# EAGLE design slave-16-mosfet (EAGLE 9.6.2)
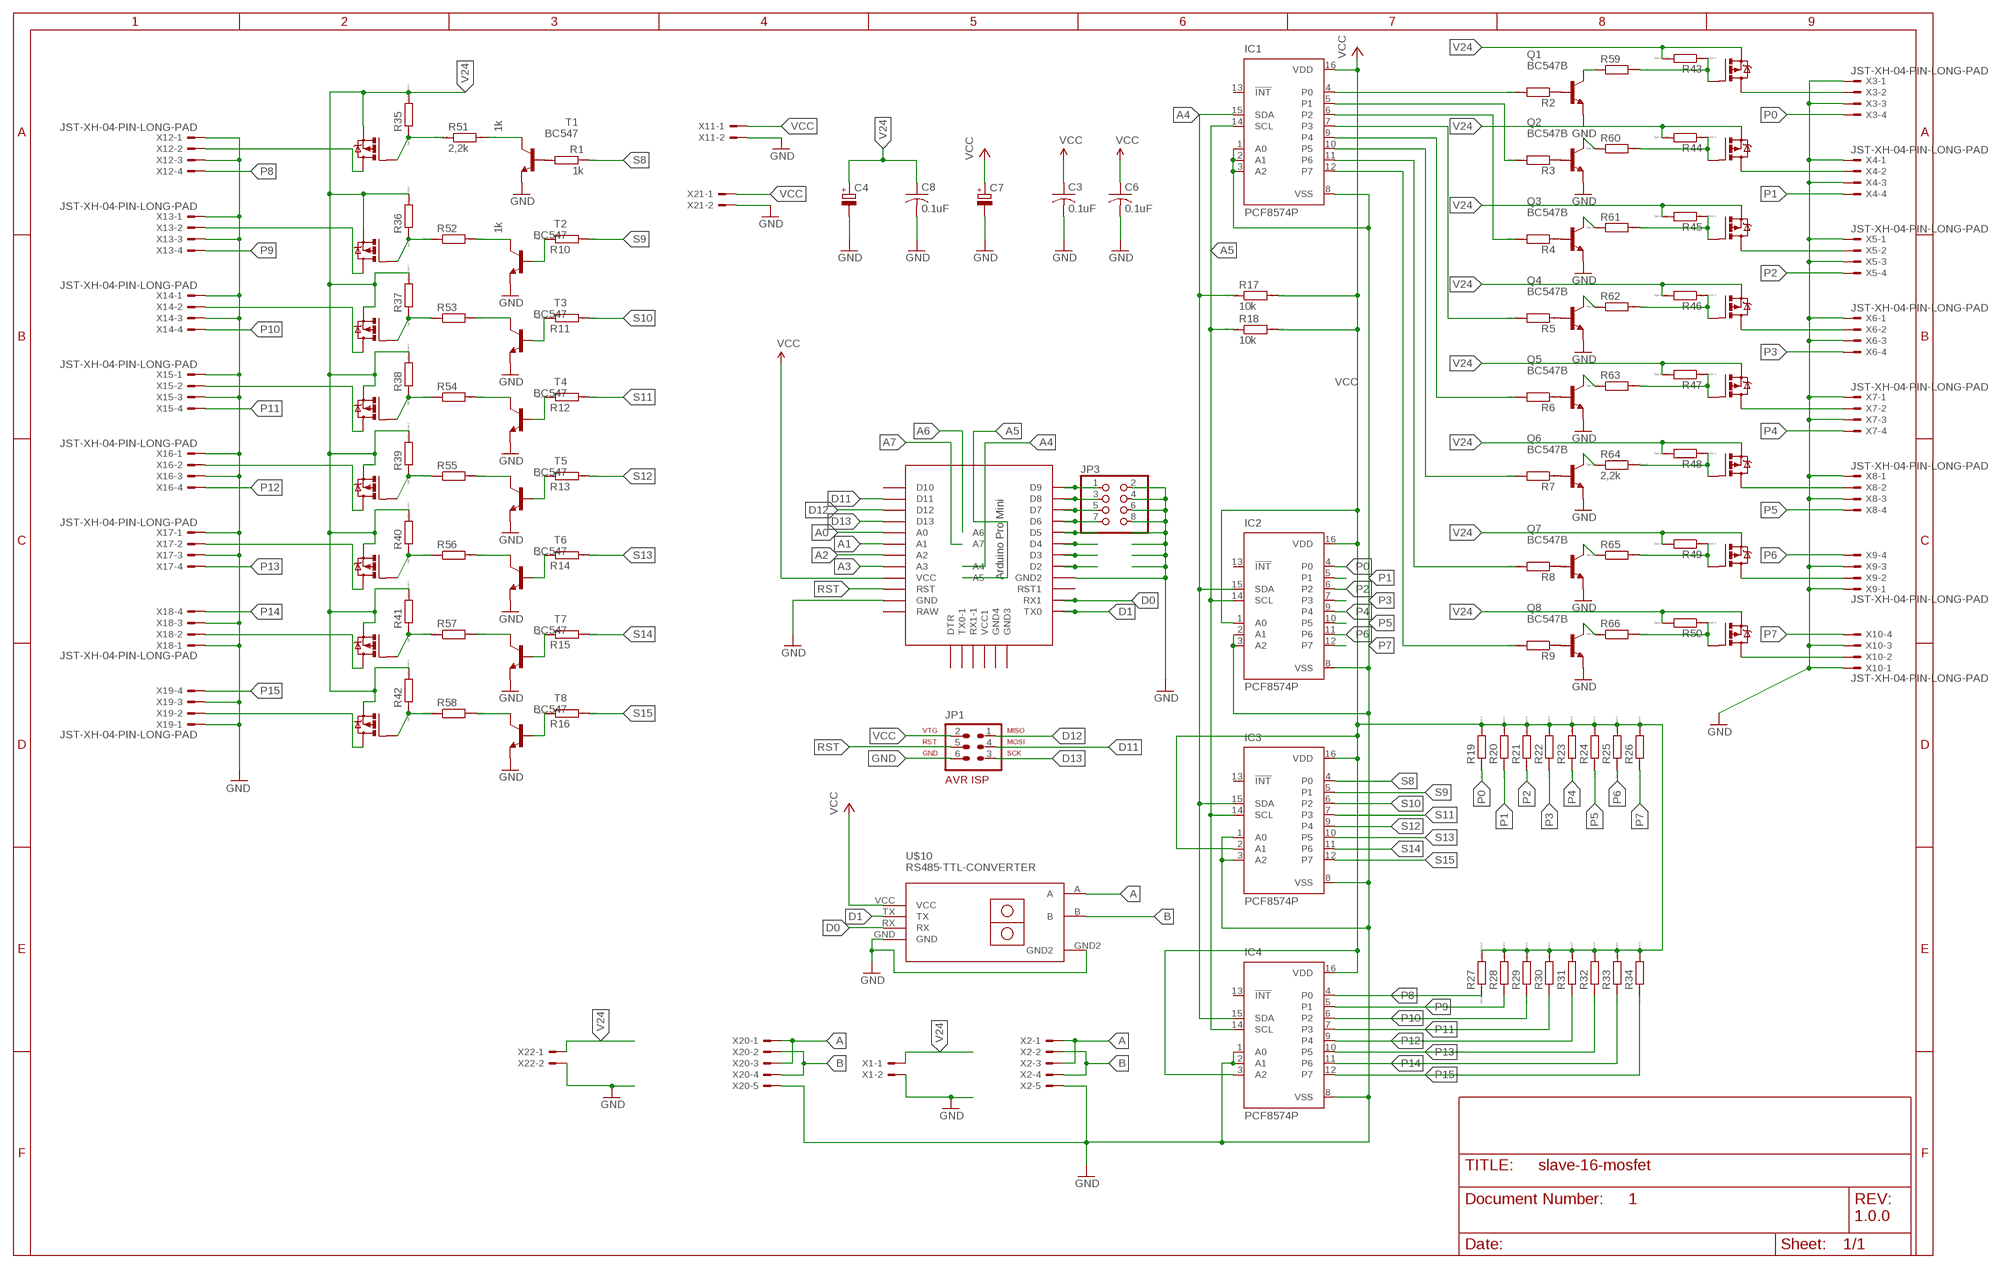
[diagram p0: schematic, sheet 1]
FRAME1 (FRAME_B_L): DESIGNER: PRATIK MAKWANA; DOC: 1; REV: 1.0.0

## Parts
C3  0.1uF  C-USC0805  [C0805]
C4  CPOL-EUSANYO_SMD_C6  [SANYO-OSCON_SMD_C6]
C6  0.1uF  C-USC0805  [C0805]
C7  CPOL-EUSANYO_SMD_C6  [SANYO-OSCON_SMD_C6]
C8  0.1uF  C-USC0805  [C0805]
IC1  PCF8574P  [DIL16]
IC2  PCF8574P  [DIL16]
IC3  PCF8574P  [DIL16]
IC4  PCF8574P  [DIL16]
JP1  AVR-ISP-6  [AVR-ISP-6]
JP3  PINHD-2X4  [2X04]
Q1  BC547B  [TO92]
Q2  BC547B  [TO92]
Q3  BC547B  [TO92]
Q4  BC547B  [TO92]
Q5  BC547B  [TO92]
Q6  BC547B  [TO92]
Q7  BC547B  [TO92]
Q8  BC547B  [TO92]
R1  1k  RR1206  [R1206]
R2  RR1206  [R1206]
R3  RR1206  [R1206]
R4  RR1206  [R1206]
R5  RR1206  [R1206]
R6  RR1206  [R1206]
R7  RR1206  [R1206]
R8  RR1206  [R1206]
R9  RR1206  [R1206]
R10  RR1206  [R1206]
R11  RR1206  [R1206]
R12  RR1206  [R1206]
R13  RR1206  [R1206]
R14  RR1206  [R1206]
R15  RR1206  [R1206]
R16  RR1206  [R1206]
R17  10k  RR1206  [R1206]
R18  10k  RR1206  [R1206]
R19  RR1206  [R1206]
R20  RR1206  [R1206]
R21  RR1206  [R1206]
R22  RR1206  [R1206]
R23  RR1206  [R1206]
R24  RR1206  [R1206]
R25  RR1206  [R1206]
R26  RR1206  [R1206]
R27  RR1206  [R1206]
R28  RR1206  [R1206]
R29  RR1206  [R1206]
R30  RR1206  [R1206]
R31  RR1206  [R1206]
R32  RR1206  [R1206]
R33  RR1206  [R1206]
R34  RR1206  [R1206]
R35  1k  RR1206  [R1206]
R36  1k  RR1206  [R1206]
R37  RR1206  [R1206]
R38  RR1206  [R1206]
R39  RR1206  [R1206]
R40  RR1206  [R1206]
R41  RR1206  [R1206]
R42  RR1206  [R1206]
R43  RR1206  [R1206]
R44  RR1206  [R1206]
R45  RR1206  [R1206]
R46  RR1206  [R1206]
R47  RR1206  [R1206]
R48  RR1206  [R1206]
R49  RR1206  [R1206]
R50  RR1206  [R1206]
R51  2,2k  RR1206  [R1206]
R52  RR1206  [R1206]
R53  RR1206  [R1206]
R54  RR1206  [R1206]
R55  RR1206  [R1206]
R56  RR1206  [R1206]
R57  RR1206  [R1206]
R58  RR1206  [R1206]
R59  RR1206  [R1206]
R60  RR1206  [R1206]
R61  RR1206  [R1206]
R62  RR1206  [R1206]
R63  RR1206  [R1206]
R64  2,2k  RR1206  [R1206]
R65  RR1206  [R1206]
R66  RR1206  [R1206]
T1  BC547  [TO92]
T2  BC547  [TO92]
T3  BC547  [TO92]
T4  BC547  [TO92]
T5  BC547  [TO92]
T6  BC547  [TO92]
T7  BC547  [TO92]
T8  BC547  [TO92]
U$1  IRF9530  [TO220BV]
U$2  IRF9530  [TO220BV]
U$3  IRF9530  [TO220BV]
U$4  IRF9530  [TO220BV]
U$5  IRF9530  [TO220BV]
U$6  IRF9530  [TO220BV]
U$7  IRF9530  [TO220BV]
U$8  IRF9530  [TO220BV]
U$10  RS485-TTL-CONVERTER  [RS485-TTL-CONVERTER]
U$12  IRF9530  [TO220BV]
U$13  IRF9530  [TO220BV]
U$14  IRF9530  [TO220BV]
U$15  IRF9530  [TO220BV]
U$16  IRF9530  [TO220BV]
U$17  IRF9530  [TO220BV]
U$18  IRF9530  [TO220BV]
U$19  IRF9530  [TO220BV]
U$20  PRO-MINI-2  [PRO-MINI-2]
X1  JST-XH-02-PIN-LONG-PAD  [JST-XH-02-PACKAGE-LONG-PAD]
X2  JST-XH-05-PIN-LONG-PAD  [JST-XH-05-PACKAGE-LONG-PAD]
X3  JST-XH-04-PIN-LONG-PAD  [JST-XH-04-PACKAGE-LONG-PAD]
X4  JST-XH-04-PIN-LONG-PAD  [JST-XH-04-PACKAGE-LONG-PAD]
X5  JST-XH-04-PIN-LONG-PAD  [JST-XH-04-PACKAGE-LONG-PAD]
X6  JST-XH-04-PIN-LONG-PAD  [JST-XH-04-PACKAGE-LONG-PAD]
X7  JST-XH-04-PIN-LONG-PAD  [JST-XH-04-PACKAGE-LONG-PAD]
X8  JST-XH-04-PIN-LONG-PAD  [JST-XH-04-PACKAGE-LONG-PAD]
X9  JST-XH-04-PIN-LONG-PAD  [JST-XH-04-PACKAGE-LONG-PAD]
X10  JST-XH-04-PIN-LONG-PAD  [JST-XH-04-PACKAGE-LONG-PAD]
X11  JST-XH-02-PIN-LONG-PAD  [JST-XH-02-PACKAGE-LONG-PAD]
X12  JST-XH-04-PIN-LONG-PAD  [JST-XH-04-PACKAGE-LONG-PAD]
X13  JST-XH-04-PIN-LONG-PAD  [JST-XH-04-PACKAGE-LONG-PAD]
X14  JST-XH-04-PIN-LONG-PAD  [JST-XH-04-PACKAGE-LONG-PAD]
X15  JST-XH-04-PIN-LONG-PAD  [JST-XH-04-PACKAGE-LONG-PAD]
X16  JST-XH-04-PIN-LONG-PAD  [JST-XH-04-PACKAGE-LONG-PAD]
X17  JST-XH-04-PIN-LONG-PAD  [JST-XH-04-PACKAGE-LONG-PAD]
X18  JST-XH-04-PIN-LONG-PAD  [JST-XH-04-PACKAGE-LONG-PAD]
X19  JST-XH-04-PIN-LONG-PAD  [JST-XH-04-PACKAGE-LONG-PAD]
X20  JST-XH-05-PIN-LONG-PAD  [JST-XH-05-PACKAGE-LONG-PAD]
X21  JST-XH-02-PIN-LONG-PAD  [JST-XH-02-PACKAGE-LONG-PAD]
X22  JST-XH-02-PIN-LONG-PAD  [JST-XH-02-PACKAGE-LONG-PAD]

## Nets
A: U$10.A X2.1 X2.3 X20.1 X20.3
A0: U$20.A0
A1: U$20.A1
A2: U$20.A2
A3: U$20.A3
A4: IC1.15(SDA) IC2.15(SDA) IC3.15(SDA) IC4.15(SDA) R17.1 U$20.A4
A5: IC1.14(SCL) IC2.14(SCL) IC3.14(SCL) IC4.14(SCL) R18.1 U$20.A5
A6: U$20.A6
A7: U$20.A7
B: U$10.B X2.2 X2.4 X20.2 X20.4
D0: U$10.RX U$20.RX1
D1: U$10.TX U$20.TX0
D11: JP1.4 U$20.D11
D12: JP1.1 U$20.D12
D13: JP1.3 U$20.D13
GND: C3.2 C4.- C6.2 C7.- C8.2 IC1.1(A0) IC1.2(A1) IC1.3(A2) IC1.8(VSS) IC2.2(A1) IC2.3(A2) IC2.8(VSS) IC3.1(A0) IC3.3(A2) IC3.8(VSS) IC4.1(A0) IC4.2(A1) IC4.8(VSS) JP1.6 JP3.2 JP3.4 JP3.6 JP3.8 Q1.1(E) Q2.1(E) Q3.1(E) Q4.1(E) Q5.1(E) Q6.1(E) Q7.1(E) Q8.1(E) T1.1(E) T2.1(E) T3.1(E) T4.1(E) T5.1(E) T6.1(E) T7.1(E) T8.1(E) U$10.GND U$10.GND2 U$20.GND U$20.GND1(GND2) X1.2 X2.5 X3.1 X3.3 X4.1 X4.3 X5.1 X5.3 X6.1 X6.3 X7.1 X7.3 X8.1 X8.3 X9.1 X9.3 X10.1 X10.3 X11.2 X12.1 X12.3 X13.1 X13.3 X14.1 X14.3 X15.1 X15.3 X16.1 X16.3 X17.1 X17.3 X18.1 X18.3 X19.1 X19.3 X20.5 X21.2 X22.2
N$1: Q8.2(B) R9.1
N$2: Q7.2(B) R8.1
N$3: R15.1 T7.2(B)
N$4: Q6.2(B) R7.1
N$5: Q5.2(B) R6.1
N$6: Q4.2(B) R5.1
N$7: Q3.2(B) R4.1
N$8: Q2.2(B) R3.1
N$9: Q1.2(B) R2.1
N$10: U$20.D2
N$12: R44.1 R60.2 U$2.G
N$13: R45.1 R61.2 U$3.G
N$14: R46.1 R62.2 U$4.G
N$15: U$1.D X3.2
N$16: U$2.D X4.2
N$17: U$20.D3
N$18: U$3.D X5.2
N$19: U$4.D X6.2
N$20: U$20.D4
N$21: U$20.D5
N$22: JP3.7 U$20.D6
N$23: JP3.5 U$20.D7
N$24: JP3.3 U$20.D8
N$25: JP3.1 U$20.D9
N$26: R1.2 T1.2(B)
N$27: R35.1 R51.1 U$12.G
N$28: R42.1 R58.1 U$19.G
N$29: R40.1 R56.1 U$17.G
N$30: IC1.4(P0) R2.2
N$31: IC1.5(P1) R3.2
N$32: IC1.6(P2) R4.2
N$33: IC1.7(P3) R5.2
N$34: IC1.9(P4) R6.2
N$35: IC1.10(P5) R7.2
N$36: IC1.11(P6) R8.2
N$37: IC1.12(P7) R9.2
N$38: R16.1 T8.2(B)
N$39: R14.1 T6.2(B)
N$40: U$5.D X7.2
N$41: U$6.D X8.2
N$42: U$7.D X9.2
N$43: R39.1 R55.1 U$16.G
N$44: R41.1 R57.1 U$18.G
N$45: R13.1 T5.2(B)
N$46: U$12.D X12.2
N$47: U$13.D X13.2
N$48: U$14.D X14.2
N$49: U$15.D X15.2
N$50: U$16.D X16.2
N$51: U$17.D X17.2
N$52: U$18.D X18.2
N$53: U$19.D X19.2
N$54: U$8.D X10.2
N$55: R38.1 R54.1 U$15.G
N$56: R50.1 R66.2 U$8.G
N$57: R12.1 T4.2(B)
N$58: R37.1 R53.1 U$14.G
N$59: R49.1 R65.2 U$7.G
N$60: R11.1 T3.2(B)
N$61: R10.1 T2.2(B)
N$62: R36.1 R52.1 U$13.G
N$63: R48.1 R64.2 U$6.G
N$64: R47.1 R63.2 U$5.G
N$65: R58.2 T8.3(C)
N$66: R57.2 T7.3(C)
N$67: R56.2 T6.3(C)
N$68: R55.2 T5.3(C)
N$69: R54.2 T4.3(C)
N$70: R53.2 T3.3(C)
N$71: R52.2 T2.3(C)
N$72: R51.2 T1.3(C)
N$73: Q8.3(C) R66.1
N$74: Q7.3(C) R65.1
N$75: Q6.3(C) R64.1
N$76: Q5.3(C) R63.1
N$77: Q4.3(C) R62.1
N$78: Q3.3(C) R61.1
N$79: Q2.3(C) R60.1
N$80: Q1.3(C) R59.1
N$81: R43.1 R59.2 U$1.G
P0: IC2.4(P0) R19.1 X3.4
P1: IC2.5(P1) R20.1 X4.4
P2: IC2.6(P2) R21.1 X5.4
P3: IC2.7(P3) R22.1 X6.4
P4: IC2.9(P4) R23.1 X7.4
P5: IC2.10(P5) R24.1 X8.4
P6: IC2.11(P6) R25.1 X9.4
P7: IC2.12(P7) R26.1 X10.4
P8: IC4.4(P0) R27.1 X12.4
P9: IC4.5(P1) R28.1 X13.4
P10: IC4.6(P2) R29.1 X14.4
P11: IC4.7(P3) R30.1 X15.4
P12: IC4.9(P4) R31.1 X16.4
P13: IC4.10(P5) R32.1 X17.4
P14: IC4.11(P6) R33.1 X18.4
P15: IC4.12(P7) R34.1 X19.4
RST: JP1.5 U$20.RST
S8: IC3.4(P0) R1.1
S9: IC3.5(P1) R10.2
S10: IC3.6(P2) R11.2
S11: IC3.7(P3) R12.2
S12: IC3.9(P4) R13.2
S13: IC3.10(P5) R14.2
S14: IC3.11(P6) R15.2
S15: IC3.12(P7) R16.2
V24: C4.+ C8.1 R35.2 R36.2 R37.2 R38.2 R39.2 R40.2 R41.2 R42.2 R43.2 R44.2 R45.2 R46.2 R47.2 R48.2 R49.2 R50.2 U$1.S U$2.S U$3.S U$4.S U$5.S U$6.S U$7.S U$8.S U$12.S U$13.S U$14.S U$15.S U$16.S U$17.S U$18.S U$19.S X1.1 X22.1
VCC: C3.1 C6.1 C7.+ IC1.16(VDD) IC2.1(A0) IC2.16(VDD) IC3.2(A1) IC3.16(VDD) IC4.3(A2) IC4.16(VDD) JP1.2 R17.2 R18.2 R19.2 R20.2 R21.2 R22.2 R23.2 R24.2 R25.2 R26.2 R27.2 R28.2 R29.2 R30.2 R31.2 R32.2 R33.2 R34.2 U$10.VCC U$20.VCC X11.1 X21.1
Unconnected: IC1.13(!INT) IC2.13(!INT) IC3.13(!INT) IC4.13(!INT) U$20.D10 U$20.DTR U$20.GND2(GND3) U$20.GND3(GND4) U$20.RAW U$20.RST1 U$20.RX1-1 U$20.TX0-1 U$20.VCC1

## Library data of the parts
C3 C6 C8 = adafruit:C-US: CAPACITOR, American symbol
C4 C7 = rcl:CPOL-EU: POLARIZED CAPACITOR, European symbol; SPICEPREFIX: C
IC1-IC4 = micro-philips:PCF8574: I2C-Bus Remote 8-bit I/O expander http://www.semiconductors.philips.com/acrobat_download/datasheets/PCF8574_4.pdf; MPN: PCF8574PN; OC_FARNELL: 204020; OC_NEWARK: 11N8515
JP1 = atmel-1:AVR-ISP-6: AVR ISP-6 Serial Programming Header
JP3 = adafruit:PINHD-2X4: PIN HEADER
Q1-Q8 = transistor-npn:BC547*: NPN Transistor
R1-R66 = eagle-ltspice:R: RESISTOR, European symbol; SPICEMODEL: NONE; SPICEPREFIX: R
T1-T8 = transistor:BC547: NPN TRANSISTOR
U$1-U$8 U$12-U$19 = transistor-power:IRF9530: P-CHANNEL HEXFET POWER-MOS-FET Source: http://www.irf.com/product-info/datasheets/data/irf9530.pdf
U$10 = zort-library:RS485-TTL-CONVERTER: RS485 to TTL converter based on MAX485 chip
U$20 = Arduino-clone:PRO-MINI-2: Arduino Pro Mini Layout 2 Sparkfun.com
X1 X11 X21 X22 = Rembrandt Electronics - JST XH Connectors v1-0:JST-XH-02-PIN: JST XH Connector 2 Pin Wire to board connector. Pitch: 2,54 mm, (0.100") Number of pins: 2 Created by Rembrandt Electronics www.rembrandtelectronics.com
X2 X20 = Rembrandt Electronics - JST XH Connectors v1-0:JST-XH-05-PIN: JST XH Connector 2 Pin Wire to board connector. Pitch: 2,54 mm, (0.100") Number of pins: 5 Created by Rembrandt Electronics www.rembrandtelectronics.com
X3-X10 X12-X19 = Rembrandt Electronics - JST XH Connectors v1-0:JST-XH-04-PIN: JST XH Connector 2 Pin Wire to board connector. Pitch: 2,54 mm, (0.100") Number of pins: 4 Created by Rembrandt Electronics www.rembrandtelectronics.com

## Board
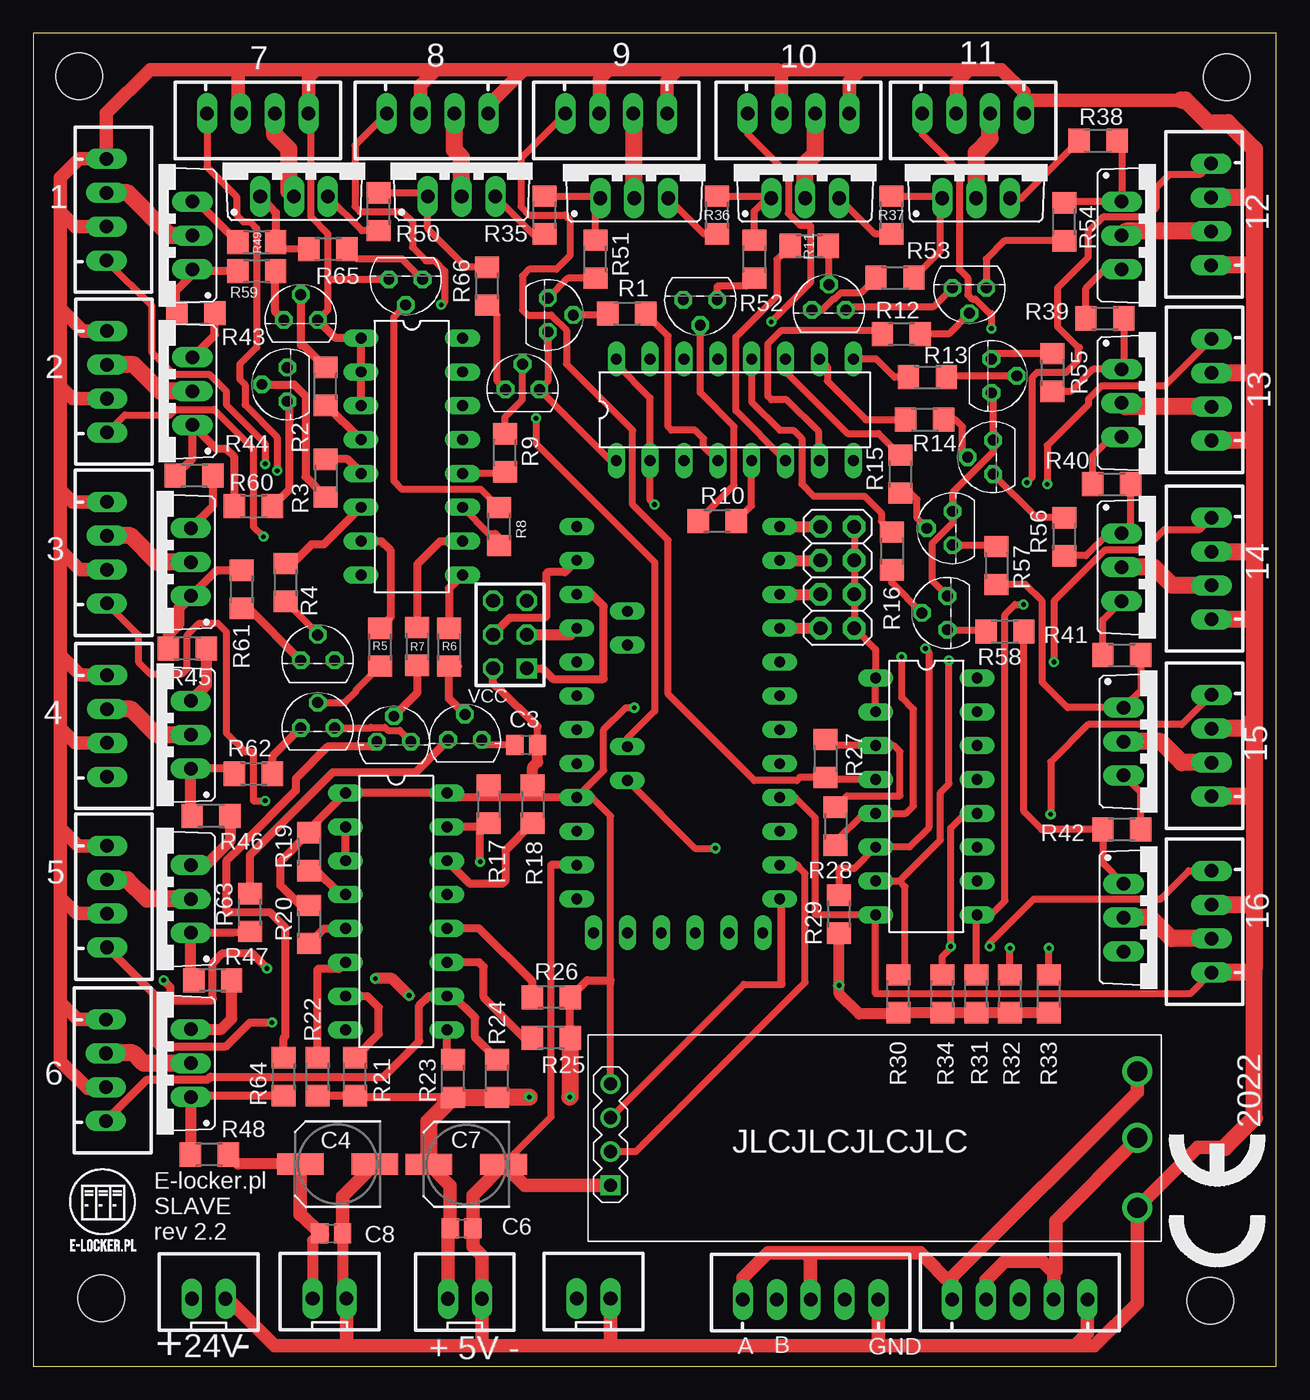
[diagram p1: board, top side]
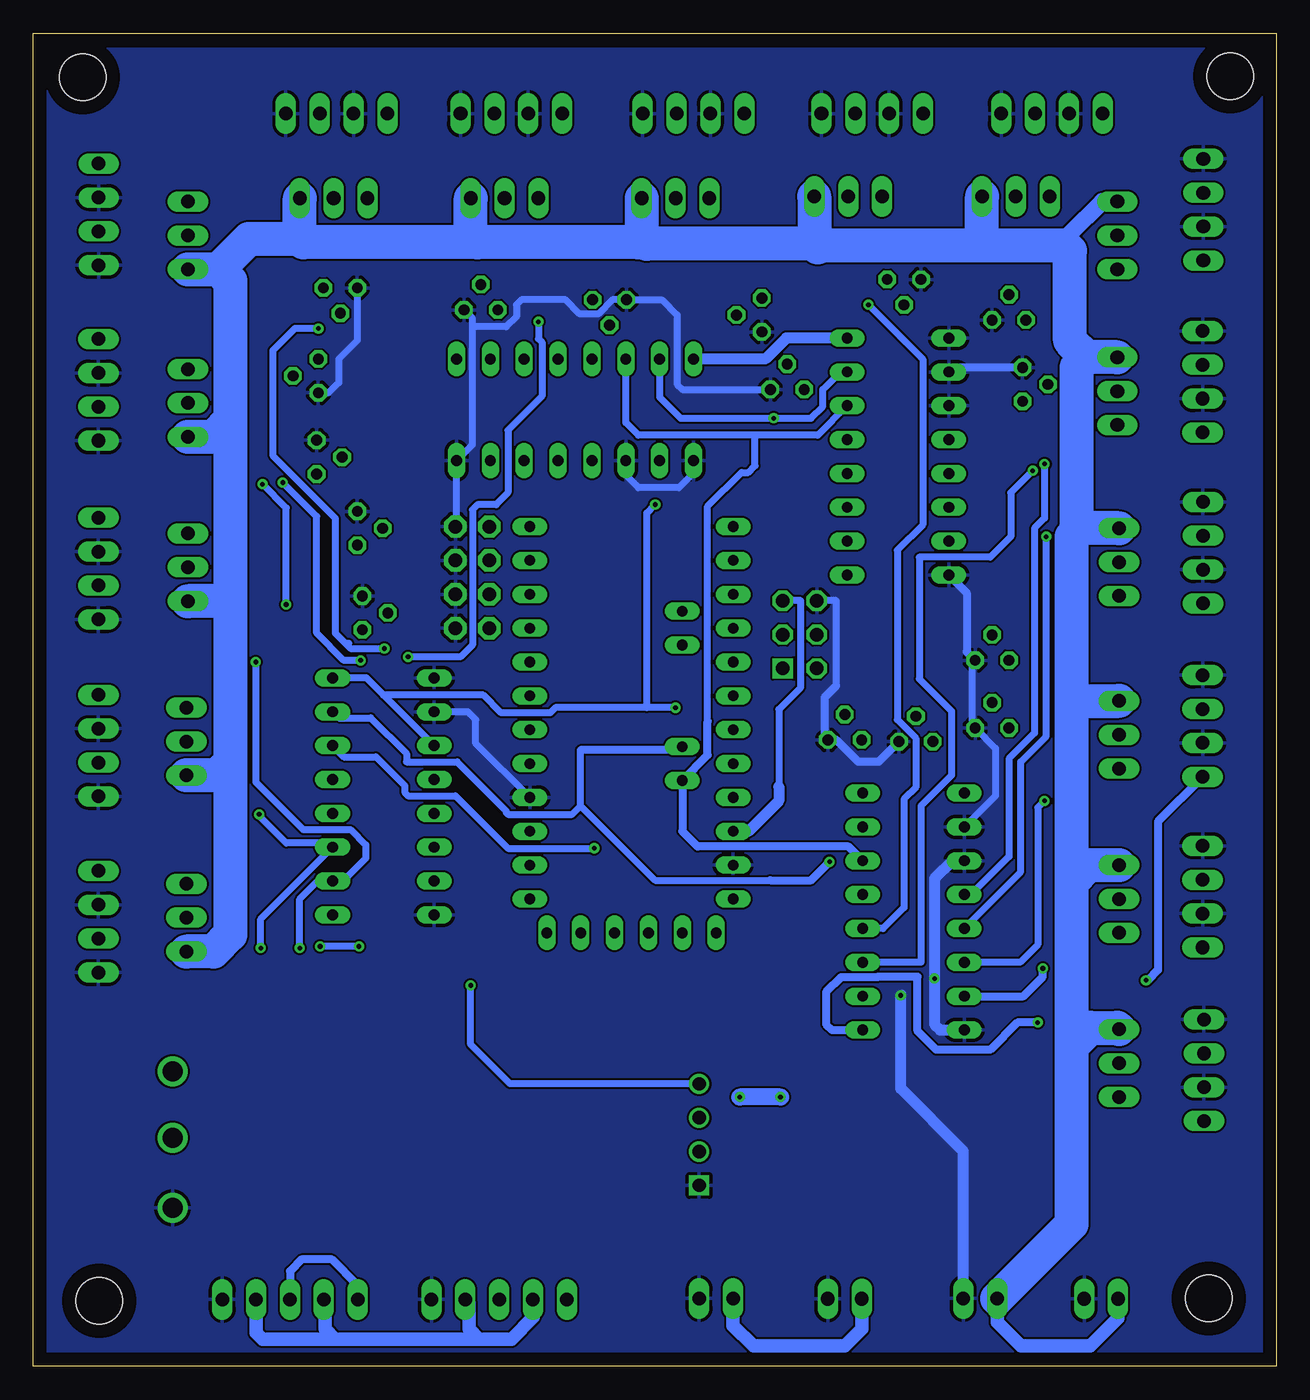
[diagram p2: board, bottom side, seen from below]

Size 93.27 x 100 mm. Coordinates in mm from the lower left corner, seen from the top.
Outline: 0,0 93.27,0 93.27,100 0,100 0,0
Copper layers (1*16): Top 0.035mm / dielectric 1.5mm / Bottom 0.035mm
Design rules "default": minimum track width 6mil, minimum drill 0.35mm, track to track 6mil, track to pad 6mil, pad to pad 6mil, via to via 6mil, smd to smd 6mil, copper to edge 40mil, drill to drill 6mil, minimum pad ring 10mil, minimum via ring 8mil, stop-mask expansion 4mil, vias tented up to drill 0mil, thermal gap 10mil
Holes 3.5 mm at 5.08,5.08 88.32,4.9 89.56,96.7 3.45,96.77

### Footprints (pad centres in the part's own frame; a part is rotated, then mirrored left to right if it is on the bottom)
C0805 = smd 1.3 x 1.5: 1 -0.85,0; 2 0.85,0
SANYO-OSCON_SMD_C6 = smd 3.5 x 1.6: + 2.8,0; - -2.8,0
DIL16 = drill 0.813 long: 1 -8.89,-3.81; 2 -6.35,-3.81; 3 -3.81,-3.81; 4 -1.27,-3.81; 5 1.27,-3.81; 6 3.81,-3.81; 7 6.35,-3.81; 8 8.89,-3.81; 9 8.89,3.81; 10 6.35,3.81; 11 3.81,3.81; 12 1.27,3.81; 13 -1.27,3.81; 14 -3.81,3.81; 15 -6.35,3.81; 16 -8.89,3.81
AVR-ISP-6 = drill 1.016 square: 1 -2.54,-1.27 | drill 1.016 octagon: 2 -2.54,1.27; 3 0,-1.27; 4 0,1.27; 5 2.54,-1.27; 6 2.54,1.27
2X04 = drill 1.016 pad 1.676 octagon: 1 -3.81,-1.27; 2 -3.81,1.27; 3 -1.27,-1.27; 4 -1.27,1.27; 5 1.27,-1.27; 6 1.27,1.27; 7 3.81,-1.27; 8 3.81,1.27
TO92 = drill 0.813 octagon: 1 1.27,0; 2 0,1.905; 3 -1.27,0
R1206 = smd 1.6 x 1.803: 1 -1.422,0; 2 1.422,0
TO220BV = drill 1.016 long: D 0,-2.54; G -2.54,-2.54; S 2.54,-2.54
RS485-TTL-CONVERTER = drill 1.5: A 41.2,12.75; B 41.2,7.75; GND2 41.2,2.5 | drill 1 square: GND 1.68,4.19 | drill 1: RX 1.68,6.73; TX 1.68,9.27; VCC 1.68,11.81
PRO-MINI-2 = drill 0.8 long: A0 6.35,2.54; A1 6.35,0; A2 6.35,-2.54; A3 6.35,-5.08; A4 2.54,1.27; A5 2.54,3.81; A6 2.54,-8.89; A7 2.54,-6.35; D2 -8.89,2.54; D3 -8.89,0; D4 -8.89,-2.54; D5 -8.89,-5.08; D6 -8.89,-7.62; D7 -8.89,-10.16; D8 -8.89,-12.7; D9 -8.89,-15.24; D10 6.35,-15.24; D11 6.35,-12.7; D12 6.35,-10.16; D13 6.35,-7.62; DTR 5.08,15.24; GND 6.35,10.16; GND1 -8.89,5.08; GND2 -7.62,15.24; GND3 -5.08,15.24; RAW 6.35,12.7; RST 6.35,7.62; RST1 -8.89,7.62; RX1 -8.89,10.16; RX1-1 0,15.24; TX0 -8.89,12.7; TX0-1 2.54,15.24; VCC 6.35,5.08; VCC1 -2.54,15.24
JST-XH-02-PACKAGE-LONG-PAD = drill 1.016 long: 1 -1.27,0; 2 1.27,0
JST-XH-05-PACKAGE-LONG-PAD = drill 1.016 long: 1 -5.08,0; 2 -2.54,0; 3 0,0; 4 2.54,0; 5 5.08,0
JST-XH-04-PACKAGE-LONG-PAD = drill 1.016 long: 1 -3.81,0; 2 -1.27,0; 3 1.27,0; 4 3.81,0

### Placement (x,y rotation side)
C3  36.98,46.61 180 top
C4  22.83,15.16 180 top
C6  32.13,10.34 0 top
C7  32.49,15.14 180 top
C8  22.35,9.96 0 top
IC1  28.4,68.25 270 top
IC2  27.23,34.11 270 top
IC3  52.63,71.75 0 top
IC4  67.01,42.75 270 top
JP1  35.76,54.89 90 top
JP3  60.33,59.18 270 top
Q1  20.07,78.49 0 top
Q2  19.05,73.66 90 top
Q3  21.34,52.96 0 top
Q4  21.34,47.88 0 top
Q5  32.38,46.99 0 top
Q6  27.05,46.86 0 top
Q7  27.94,81.53 180 top
Q8  36.7,73.28 0 top
R1  44.53,78.97 180 top
R2  21.92,73.51 270 top
R3  21.95,66.62 90 top
R4  18.92,58.8 90 top
R5  26.01,53.95 90 top
R6  31.19,53.95 90 top
R7  28.8,54 90 top
R8  34.95,62.99 270 top
R9  35.38,68.53 270 top
R10  51.31,63.4 0 top
R11  58.22,84.05 180 top
R12  65.13,77.44 180 top
R13  67.08,74.19 180 top
R14  66.88,71.02 180 top
R15  65.05,66.93 90 top
R16  64.41,61.16 90 top
R17  34.16,42.16 90 top
R18  37.47,42.16 90 top
R19  20.7,38.61 90 top
R20  20.7,33.15 90 top
R21  21.34,21.72 270 top
R22  24.13,21.72 270 top
R23  31.5,21.59 270 top
R24  34.8,21.59 270 top
R25  38.86,24.64 0 top
R26  38.86,27.69 0 top
R27  59.44,45.59 90 top
R28  60.2,40.51 90 top
R29  60.45,33.91 270 top
R30  64.9,27.94 270 top
R31  70.74,27.94 270 top
R32  73.28,27.94 270 top
R33  76.2,27.94 270 top
R34  68.2,27.94 270 top
R35  38.35,86.36 270 top
R36  51.31,86.36 270 top
R37  64.39,86.36 270 top
R38  79.88,91.95 180 top
R39  80.39,78.61 180 top
R40  80.9,66.17 180 top
R41  81.66,53.34 180 top
R42  81.66,40.26 0 top
R43  12.19,78.99 0 top
R44  12.06,66.8 0 top
R45  11.56,53.85 0 top
R46  13.34,41.27 0 top
R47  13.46,28.96 0 top
R48  13.21,15.88 0 top
R49  16.76,84.33 180 top
R50  25.91,86.61 270 top
R51  42.16,83.06 270 top
R52  54.1,83.06 270 top
R53  64.64,81.66 180 top
R54  77.34,85.85 270 top
R55  76.45,74.55 90 top
R56  77.34,62.23 90 top
R57  72.26,60.07 90 top
R58  72.9,55.12 180 top
R59  16.76,82.17 180 top
R60  16.51,64.52 180 top
R61  15.62,58.29 90 top
R62  16.51,44.45 180 top
R63  16.26,34.04 270 top
R64  18.8,21.72 270 top
R65  22.1,83.82 180 top
R66  34.04,81.03 90 top
T1  38.61,78.87 270 top
T2  50.04,80.01 180 top
T3  59.69,79.25 0 top
T4  70.23,80.9 180 top
T5  71.88,74.3 270 top
T6  72.01,68.2 90 top
T7  68.96,62.87 90 top
T8  68.58,56.52 90 top
U$1  9.4,84.84 90 top
U$2  9.4,73.15 90 top
U$3  9.27,60.33 90 top
U$4  9.27,47.37 90 top
U$5  9.27,35.05 90 top
U$6  9.27,22.73 90 top
U$7  19.56,90.3 0 top
U$8  32.13,90.3 0 top
U$9  [ELOCKER]  2.69,8.41 0 top
U$10  41.63,9.37 0 top
U$11  [CE_7.3MM]  92.46,7.37 90 top
U$12  45.09,90.17 0 top
U$13  57.91,90.17 0 top
U$14  70.74,90.17 0 top
U$15  84.2,84.84 270 top
U$16  84.2,72.26 270 top
U$17  84.2,59.94 270 top
U$18  84.33,46.86 270 top
U$19  84.33,33.66 270 top
U$20  47.12,47.75 180 top
X1  13.16,5.05 0 top
X2  58.32,5 0 top
X3  5.49,86.77 270 top
X4  5.54,73.86 270 top
X5  5.51,61.04 270 top
X6  5.54,48.03 270 top
X7  5.54,35.23 270 top
X8  5.44,22.2 270 top
X9  16.84,93.98 180 top
X10  30.33,93.98 180 top
X11  32.38,5.05 0 top
X12  43.74,93.98 180 top
X13  57.4,93.98 180 top
X14  70.51,93.98 180 top
X15  88.37,86.41 90 top
X16  88.39,73.25 90 top
X17  88.39,59.84 90 top
X18  88.39,46.56 90 top
X19  88.39,33.35 90 top
X20  74.02,5 0 top
X21  42.04,5.08 0 top
X22  22.23,5.08 0 top

### Tracks (layer width: path | path; a pad name or v marks a point on that pad's centre or on a via)
A
  Top 0.508: 68.94,6.66 68.94,5.84 X20.1
  Top 1.016: X2.1 53.24,6.63 55.12,8.51 57.91,8.51 | 57.91,8.51 58.32,8.1 X2.3 | 57.91,8.51 66.55,8.51 68.94,6.12 68.94,5.84 | X20.1 68.94,6.66 82.83,20.55 U$10.A
  Bottom 0.61: X20.1 68.94,6.07 70.87,8 73.15,8 74.02,7.14 X20.3
A4  (via drill 0.35)
  Top 0.508: v37.72,71.12 37.72,69.22 46.61,60.33 46.61,49.15 44.58,47.12 U$20.A4
  Top 0.61: IC2.15 33.88,40.46 R17.1 33.53,40.11 v33.53,37.85
  Top 0.813: R17.1 34.31,40.89
  Bottom 0.508: 52.2,42.04 46.61,36.45 37.97,36.45 | 52.2,42.04 52.2,46.23 | IC3.15 46.28,72.69 44.7,71.12 v37.72,71.12 34.92,71.12 34.04,72.01 34.04,73.28 32.72,74.6 IC1.15 | IC4.15 70.36,48.64 67.94,48.64 65.28,45.97 65.28,45.34 61.47,45.34 57.78,41.66 57.78,41.53 57.66,41.4 52.83,41.4 52.2,42.04
  Bottom 0.61: U$20.A4 44.83,46.23 52.2,46.23 | 37.97,36.45 34.92,36.45 v33.53,37.85
A5  (via drill 0.35)
  Top 0.508: U$20.A5 49.66,38.86 v51.18,38.86
  Top 0.61: R18.1 35.43,38.71 35.43,36.45 35.18,36.2 32.77,36.2 IC2.14
  Bottom 0.508: IC1.14 34.42,69.85 39.12,69.85 | IC3.14 48.82,70.79 47.88,69.85 39.12,69.85 | 42.67,48.39 42.67,64.52 40.13,67.06 39.62,67.06 39.12,67.56 39.12,69.85 | IC4.14 69.98,45.72 67.56,45.72 65.41,43.56 65.41,43.05 65.15,42.8 61.59,42.8 57.66,38.86 v51.18,38.86
  Bottom 0.61: 42.67,48.39 42.67,45.85 U$20.A5 44.58,40.13 43.43,38.99 32.11,38.99 IC2.14
B
  Top 0.508: 76.56,6.96 76.71,7.11
  Top 1.016: X20.2 71.48,6.45 72.9,7.87 75.69,7.87 76.56,7.01 76.56,6.96 X20.4 | 76.71,7.11 76.71,10.92 82.83,17.05 U$10.B
  Bottom 0.508: X2.4
  Bottom 1.016: X2.2 55.78,3.66 57.4,2.03 59.82,2.03 | 59.82,2.03 60.58,2.79 60.58,4.72 X2.4 | 59.82,2.03 70.61,2.03 | 70.61,2.03 71.37,2.79 71.37,4.9 X20.2 | 70.61,2.03 76.07,2.03 76.56,2.52 X20.4
D0
  Top 0.508: U$10.RX 45.22,16.1 57.91,28.8 57.91,36.96 57.4,37.47 57.2,37.67
  Top 0.61: U$20.RX1 57.28,37.59 57.4,37.47
D1
  Top 0.508: U$10.TX 53.31,28.65 56.13,28.65
  Top 0.61: U$20.TX0 56.13,34.92 56.13,28.65
D11
  Top 0.61: U$20.D11 39.88,59.56 38.61,59.56 38.48,59.44 38.48,56.26 38.35,56.13 35.74,56.13 JP1.4
D12
  Top 0.61: JP1.1 38.2,52.35 38.99,51.56 42.8,51.56 42.8,57.02 41.91,57.91 U$20.D12
D13
  Top 0.813: JP1.3 40.28,54.89 U$20.D13
GND  (via drill 0.35)
  Top 0.406: 40.41,1.52 40.41,1.27 18.21,1.27 X1.2
  Top 0.508: C7.- 38.86,18.71 38.86,37.59 | C3.2 34.04,46.61 Q5.1 | 22.1,81.53 22.1,84.96 20.83,86.23 20.83,93.8 X9.1 | 22.1,81.53 22.1,79.25 Q1.1 | Q7.1 22.1,81.53 | IC3.1 43.31,67.94 Q8.1 38.61,73.91 T1.1 | JP3.2 JP3.4 JP3.6 JP3.8 63.2,53.77 IC4.1 IC4.2 | T3.1 61.21,79.5 67.56,79.5 T4.1 | T5.1 72.01,72.9 T6.1 72.01,68.58 68.96,65.53 T7.1 68.96,63.25 67.44,61.72 67.44,58.93 T8.1 | X19.1 86.79,27.94 63.2,27.94 IC4.8 58.73,33.86 58.67,33.91 58.67,41.15 57.15,42.67 U$20.GND1 | Q4.1 25.29,47.88 25.34,47.93 26.38,47.93 26.61,47.7 27.48,47.7 Q6.1
  Top 0.61: U$20.GND 38.86,37.59 | Q1.1 22.68,77.14 IC1.1 IC1.2 IC1.3 | IC2.3 IC2.2
  Top 0.813: C8.2 23.2,5.37 X22.2 | v28.19,27.81 26.92,29.08 v25.65,29.08
  Top 1.016: C8.2 23.2,12.73 C4.- | 33.66,1.52 X11.2 33.66,8.27 32.98,8.94 C6.2 32.98,12.83 C7.- 36.86,13.56 U$10.GND | 33.66,1.52 40.41,1.52 43.31,1.52 | 63.4,1.52 X2.5 | X20.5 79.1,2.46 78.16,1.52 | 78.16,1.52 63.4,1.52 | 78.16,1.52 79.62,1.52 82.83,4.74 U$10.GND2 87.38,16.42 89.41,16.42 | 86.11,95 74.55,95 74.32,94.77 X14.1 74.32,95.61 72.64,97.28 70.23,97.28 | X14.3 69.24,96.29 70.23,97.28 | 70.23,97.28 62.1,97.28 | X13.1 61.21,96.39 62.1,97.28 | 62.1,97.28 56.39,97.28 56.13,97.03 | 56.13,97.03 X13.3 | 56.13,97.03 55.88,97.28 48.39,97.28 | 48.39,97.28 47.55,96.44 X12.1 | 48.39,97.28 43.18,97.28 | X12.3 42.47,96.57 43.18,97.28 | 43.18,97.28 36.83,97.28 | 36.83,97.28 34.14,94.59 X10.1 | X10.3 29.06,96.11 30.23,97.28 | 36.83,97.28 30.23,97.28 | 30.23,97.28 21.21,97.28 | 21.21,97.28 20.65,96.72 X9.1 | 21.21,97.28 15.37,97.28 | 15.37,97.28 15.37,94.18 X9.3 | 15.37,97.28 8.76,97.28 5.49,94 X3.1 3.45,90.58 2.03,89.15 2.03,86.61 | X3.3 3.15,85.5 2.03,86.61 | 2.03,86.61 2.03,79.38 | X4.1 3.73,77.67 2.03,79.38 | 2.03,79.38 2.03,73.53 | X4.3 2.97,72.59 2.03,73.53 | 2.03,73.53 2.03,65.79 | X5.1 2.97,64.85 2.03,65.79 | 2.03,65.79 2.03,61.21 | X5.3 3.48,59.77 2.03,61.21 | 2.03,61.21 2.03,53.34 | X6.1 3.53,51.84 2.03,53.34 | 2.03,53.34 2.03,47.88 | X6.3 3.15,46.76 2.03,47.88 | 2.03,47.88 2.03,40.39 | X7.1 3.38,39.04 2.03,40.39 | 2.03,40.39 2.03,35.18 | X7.3 3.25,33.96 2.03,35.18 | 2.03,35.18 2.03,27.3 | X8.1 3.33,26.01 2.03,27.3 | 2.03,27.3 2.03,22.86 4.06,20.83 4.17,20.93 X8.3 | 33.66,1.52 23.5,1.52 | 23.5,1.52 18.12,1.52 14.59,5.05 X1.2 | 23.5,1.52 X22.2 | 43.31,1.52 X21.2 | 43.31,1.52 63.4,1.52
  Top 1.27: 86.11,95 86.45,95 88.15,93.3 89.63,93.3 91.62,91.31 91.62,88.19 | X15.3 91.11,87.68 91.62,88.19 | 91.62,88.19 91.62,82.73 | X15.1 91.49,82.6 91.62,82.73 | 91.62,82.73 91.62,74.8 | 91.62,74.8 91.34,74.52 X16.3 | 91.62,74.8 91.62,69.47 | 91.62,69.47 91.59,69.44 X16.1 | 91.62,69.47 91.62,61.09 | 91.62,61.09 88.42,61.09 X17.3 | 91.62,61.09 91.62,56.44 | X17.1 91.21,56.03 91.62,56.44 | 91.62,56.44 91.62,48.56 | X18.3 90.88,47.83 91.62,48.56 | 91.62,48.56 91.62,43.1 | X18.1 91.26,42.75 91.62,43.1 | 91.62,43.1 91.62,34.92 | 91.62,34.92 91.31,34.62 X19.3 | 91.62,34.92 91.62,29.9 | X19.1 91.26,29.54 91.62,29.9 | 89.41,16.42 91.62,18.63 91.62,29.9
  Bottom 0.508: IC2.2 21.08,42.8 21.08,46.35 Q4.1 22.86,48.13 22.86,52.7 Q3.1 | 33.02,51.05 33.02,57.43 JP1.6 | JP3.2 61.52,63.07 IC3.8 60.33,69.14 60.33,77.85 | IC3.1 43.74,67 44.83,65.91 47.88,65.91 48.82,66.85 IC3.3 | T4.1 68.96,76.96 70.36,75.56 70.36,73.79 71.12,73.03 T5.1 | T3.1 60.33,78.61 60.33,77.85 | U$20.GND1 60.07,46.74 60.07,48.51 60.66,49.1 IC4.2 | 60.33,77.85 60.2,77.98 57.78,77.98 57.02,78.74 57.02,79.63 56.64,80.01 53.34,80.01 52.27,78.94 50.87,78.94 49.8,80.01 T2.1 46.1,80.01 44.96,78.87 44.96,73.66 44.58,73.28 Q8.1
  Bottom 0.61: 33.02,51.05 33.91,50.16 33.91,47.24 Q5.1 33.02,46.99 31.37,45.34 29.84,45.34 Q6.1 | Q3.1 23.24,53.59 23.24,58.01 IC1.8 | Q2.1 24.26,74.93 IC1.2 | v28.19,27.81 28.07,27.94
  Bottom 0.813: IC2.3 24.31,37.92 25.65,36.58 v25.65,29.08 25.65,25.65 25.22,25.22 IC2.8 | X22.2 23.5,16.13 28.19,20.83 v28.19,27.81
  pour Bottom: 0.64,99.44 92.84,99.44 92.84,0.25 0.38,0.25 0.25,0.13 0.25,99.06
N$1
  Top 0.508: R9.1 35.38,71.2 36.7,72.52 Q8.2
N$2
  Top 0.508: R8.1 33.58,65.79 27.69,65.79 27.05,66.42 27.05,78.74 Q7.2
N$3
  Top 0.508: T7.2 66.29,63.63 66.29,65.02 65.81,65.51 R15.1
N$4
  Top 0.61: R7.1 28.8,50.52 Q6.2
N$5
  Top 0.508: 31.93,52.53 R6.1
  Top 0.61: Q5.2 31.19,50.09 R6.1
N$6
  Top 0.508: Q4.2 23.37,49.78 24.21,50.62 24.21,50.73 R5.1
N$7
  Top 0.508: R4.1 21.34,54.97 Q3.2
N$8
  Top 0.61: Q2.2 19.56,73.66 20.42,72.8 20.42,66.73 R3.1
N$9
  Top 0.61: Q1.2 20.07,76.58 20.27,76.58 R2.1
N$12
  Top 0.61: R44.1 11.94,68.1 U$2.G 13.74,68.81 14.48,68.81 15.09,68.2 R60.2
N$13
  Top 0.61: U$3.G 13.74,59.72 R61.2
  Top 0.813: U$3.G 10.92,56.9 10.92,55.65 10.13,54.86 R45.1
N$14
  Top 0.61: R62.2 14.71,44.83 U$4.G
  Top 0.813: R46.1 11.81,41.38 U$4.G
N$15
  Top 1.27: U$1.D 10.29,84.84 7.09,88.04 X3.2
N$16
  Top 1.27: U$2.D 9.53,73.15 7.54,75.13 X4.2
N$18
  Top 1.27: U$3.D 9.27,60.33 7.29,62.31 X5.2
N$19
  Top 0.508: 5.86,49.3 X6.2
  Top 1.27: U$4.D 9.27,47.37 7.34,49.3 5.86,49.3
N$22
  Top 0.813: U$20.D6 JP3.7
N$23
  Top 0.813: U$20.D7 JP3.5
N$24
  Top 0.813: U$20.D8 JP3.3
N$25
  Top 0.813: U$20.D9 JP3.1
N$26
  Top 0.508: R1.2 43,78.87 T1.2
N$27
  Top 0.508: R35.1 42.39,87.78 | 42.39,87.78 U$12.G | R51.1 42.16,87.55 42.39,87.78
N$28
  Top 0.508: U$19.G 80.24,37.74 R42.1 75.67,40.26 74.32,41.61 R58.1
N$29
  Top 0.508: R40.1 82.32,63.14 U$17.G 80.64,62.48 78.97,60.81 R56.1
N$30
  Top 0.61: IC1.4 22.02,72.09 R2.2
N$31
  Top 0.61: IC1.5 24.59,67.06 23.67,67.97 23.59,68.05 R3.2
N$32
  Top 0.61: IC1.6 21.79,61.65 20.88,61.65 19.46,60.22 R4.2
N$33
  Top 0.61: R5.2 26.8,56.16 26.8,61.21 26.11,61.9 IC1.7
N$34
  Top 0.61: IC1.9 31.19,58.34 R6.2
N$35
  Top 0.61: 28.7,55.42 R7.2 28.8,60.15 30.56,61.9 IC1.10
N$36
  Top 0.508: IC1.11 34.16,62.48 34.67,62.48 34.95,62.2 R8.2
N$37
  Top 0.508: R9.2 35.26,66.98 IC1.12
N$38
  Top 0.508: T8.2 64.41,58.78 R16.1
N$39
  Top 0.508: T6.2 69.72,68.58 69.72,70.48 69.19,71.02 R14.1
N$40
  Top 1.27: U$5.D 8.51,35.05 7.06,36.5 X7.2
N$41
  Top 1.27: U$6.D 8.26,22.73 7.49,23.5 5.46,23.5 X8.2
N$42
  Top 1.27: U$7.D 19.18,88.14 19.18,91.31 18.11,92.38 X9.2
N$43
  Top 0.508: R39.1 81.81,74.95 U$16.G 79.5,74.8 77.83,73.13 R55.1
N$44
  Top 0.508: R41.1 83.08,50.7 U$18.G 77.6,49.4 75.69,51.31 75.69,57.4 74.45,58.65 R57.1
N$45
  Top 0.508: T5.2 68.61,74.3 R13.1
N$46
  Top 0.61: 45.04,93.95 X12.2
  Top 1.27: U$12.D 45.09,93.9 45.04,93.95
N$47
  Top 0.508: X13.2 58.56,93.86 58.61,93.81
  Top 1.27: U$13.D 57.91,90.17 58.67,90.93 58.67,93.75 58.56,93.86
N$48
  Top 1.27: U$14.D 70.74,91.06 71.78,92.1 X14.2
N$49
  Top 1.27: X15.2 81.97,85.14 U$15.D
N$50
  Top 1.27: X16.2 81.94,71.98 U$16.D
N$51
  Top 1.27: X17.2 85.45,58.57 84.07,59.94 U$17.D
N$52
  Top 1.27: X18.2 86.16,45.29 84.58,46.86 U$18.D
N$53
  Top 1.27: X19.2 85.39,32.08 83.82,33.66 U$19.D
N$54
  Top 1.27: U$8.D 32.13,90.7 31.6,91.23 X10.2
N$55
  Top 0.508: R38.1 81.66,91.59 U$15.G 77.44,87.38 R54.1
N$56
  Top 0.508: R50.1 29.31,88.04 U$8.G 29.59,85.34 32.49,82.45 R66.2
N$57
  Top 0.508: T4.2 68.68,77.44 R12.1
N$58
  Top 0.508: R37.1 68.05,87.78 | 68.05,87.78 U$14.G | R53.1 68.05,83.64 68.05,87.78
N$59
  Top 0.508: R65.2 18.69,83.82 R49.1
  Top 0.61: U$7.G 17.63,87.15 17.65,87.15 18.19,86.56 R49.1
N$60
  Top 0.508: T3.2 59.69,84 R11.1
N$61
  Top 0.508: R10.1 52.58,66.09 52.58,70.48 50.04,73.03 T2.2
N$62
  Top 0.508: R36.1 55.22,87.78 | 55.22,87.78 U$13.G | R52.1 54.1,86.66 55.22,87.78
N$63
  Top 0.61: R64.2 13.04,20.3 11.87,20.13 U$6.G
  Top 0.813: U$6.G 11.81,15.9 R48.1
N$64
  Top 0.61: R63.2 14.96,32.51 U$5.G
  Top 0.813: R47.1 11.81,29.18 U$5.G
N$65
  Top 0.508: T8.3 71.35,55.24 R58.2
N$66
  Top 0.508: T7.3 72.16,61.59 R57.2
N$67
  Top 0.508: R56.2 75.29,63.65 T6.3
N$68
  Top 0.508: R55.2 72.29,75.97 T5.3
N$69
  Top 0.508: R54.2 72.87,84.43 71.5,83.06 T4.3
N$70
  Top 0.508: R53.2 62.08,80.52 60.56,80.52 60.13,80.09 60.02,80.09 59.18,79.25 T3.3
N$71
  Top 0.508: R52.2 53.49,81.03 51.31,81.03 T2.3
N$72
  Top 0.508: T1.3 40.13,81.66 42.14,81.66 R51.2
N$73
  Top 0.508: Q8.3 34.8,73.91 34.8,78.84 R66.1
N$74
  Top 0.508: Q7.3 27.69,83.06 24.28,83.06 R65.1
N$75
  Top 0.61: Q6.3 25.4,46.48 22.1,46.48 19.68,44.07 19.68,43.18 15.62,39.12 15.62,39.04 14.48,37.9 14.48,34.16 14.61,34.04 17.78,34.04 18.92,32.89 18.92,24.77 18.8,24.64 R64.1
N$76
  Top 0.61: R63.1 16.26,38.35 22.48,44.58 28.7,44.58 Q5.3
N$77
  Top 0.61: Q4.3 17.93,45.74 R62.1
N$78
  Top 0.61: Q3.3 16.15,56.87 R61.1
N$79
  Top 0.61: Q2.3 19.2,72.24 19.2,65.79 R60.1
N$80
  Top 0.61: Q1.3 18.12,79.16 18.12,82.23 R59.1
N$81
  Top 0.61: R43.1 10.67,79.1 10.67,80.64 11.94,81.92 U$1.G 12.06,82.17 R59.2
P0  (via drill 0.35)
  Top 0.508: X3.4 8.89,79.55 8.89,76.07 10.54,74.42 13.21,74.42 14.48,73.15 14.48,72.14 17.4,69.22 v17.4,67.69
  Top 0.61: IC2.4 23.04,35.38 21.23,37.19 R19.1
  Bottom 0.508: v17.4,67.69 17.4,63.63 18.16,62.87 18.16,47.5 20.07,45.59 20.07,38.23 22.91,35.38 IC2.4
P1  (via drill 0.35)
  Top 0.508: IC2.5 23.27,32.99 | X4.4 6.86,71.37 10.29,71.37 10.69,71.78 13.56,71.78 16.51,68.83 16.51,62.99 v17.27,62.23
  Top 0.61: R20.1 21.82,32.84 IC2.5
  Bottom 0.508: IC2.5 19.18,37.08 19.18,45.34 17.27,47.24 v17.27,62.23
P2  (via drill 0.35)
  Top 0.508: X5.4 7.87,54.86 7.87,52.83 8.76,51.94 11.18,51.94 11.56,52.32 11.56,54.86 12.45,55.75 13.84,55.75 14.48,55.12 14.48,47.5 15.88,46.1 16.38,46.1 16.51,45.97 16.51,42.42 v17.4,42.42
  Top 0.61: R21.1 21.34,29.79 22.91,29.79 IC2.6
  Bottom 0.508: v17.4,42.42 17.91,41.91 17.91,31.62 19.23,30.3 IC2.6
P3  (via drill 0.35)
  Top 0.508: IC2.7 22.55,27.76
  Top 0.61: R22.1 25.91,24.92 25.91,26.92 25.07,27.76 IC2.7 | v9.78,28.96 10.29,28.45 10.29,27.81 10.67,27.43 13.34,27.43 13.46,27.56 13.46,30.23 14.22,30.99 16.38,30.99 v17.53,29.84
  Bottom 0.61: X6.4 8.89,40.87 8.89,29.72 9.65,28.96 v9.78,28.96 | IC2.7 18.97,27.76 17.53,29.21 v17.53,29.84
P4  (via drill 0.35)
  Top 0.61: X7.4 9.14,27.81 9.14,24.26 9.4,24 14.48,24 16.26,25.78 v17.91,25.78 | R23.1 31.04,23.47 IC2.9
  Bottom 0.61: v17.91,25.78 19.43,25.78 21.46,23.75 25.53,23.75 26.92,25.15 26.92,29.21 29.89,29.21 29.91,29.18 32.66,29.18 33.78,28.07 33.78,25.65 33.35,25.22 IC2.9
P5
  Top 0.61: X8.4 8.56,21.51 13.08,21.51 13.28,21.72 26.29,21.72 28.96,24.38 28.96,27.05 29.67,27.76 IC2.10 31.55,27.76 33.15,26.16 33.15,24.66 R24.1
P6  (via drill 0.35)
  Top 0.508: R25.1 37.36,24.71 | X9.4 13.03,89.97 15.24,87.76 15.24,86.36 15.75,85.85 16.26,85.85 16.76,85.34 16.76,76.45 15.49,75.18 15.49,74.04 15.88,73.66 15.88,72.14 18.29,69.72 v18.29,67.18
  Top 0.61: IC2.11 33.45,30.3 33.78,29.97 33.78,27.69 36.83,24.64 R25.1
  Bottom 0.508: v18.29,67.18 19.94,65.53 19.94,62.23 21.46,60.71 26.8,60.71 26.8,51.56 24.38,49.15 24.38,44.32 26.67,42.04 26.67,30.3 IC2.11
P7  (via drill 0.35)
  Top 0.508: R26.1 37.39,27.64 | X10.4 24.13,91.59 24.13,87 24.51,86.61 27.69,86.61 28.45,85.85 28.45,83.95 29.46,82.93 30.1,82.93 30.86,82.17 30.86,79.88 v30.61,79.63
  Top 0.61: R26.1 37.44,28.85 33.45,32.84 IC2.12
  Bottom 0.508: v30.61,79.63 26.54,75.56 26.54,63.12 28.45,61.21 28.45,48.51 27.05,47.12 27.05,43.43 27.94,42.55 27.94,34.42 29.52,32.84 IC2.12
P8
  Top 0.508: X12.4 36.58,90.63 36.58,87 37.21,86.36 39.88,86.36 40.26,85.98 40.26,83.31 39.24,82.3 37.21,82.3 36.7,81.79 36.7,79.25 37.08,78.87 38.86,78.87 40.01,77.72 40.01,75.18 44.96,70.23 44.96,64.64 47.62,61.98 47.62,50.42 54.1,43.94 57.28,43.94 57.51,44.17 R27.1 59.59,44.02 IC4.4
P9  (via drill 0.35)
  Top 0.508: R28.1 60.2,39.37 62.31,41.48 IC4.5 65.48,41.48 66.04,42.04 66.04,49.28 65.15,50.16 v65.15,53.21 | X13.4 53.59,92.46 56.64,89.41 56.64,86.49 57.53,85.6 58.29,85.6 58.29,81.28 v55.37,78.36
  Bottom 0.508: v55.37,78.36 55.37,77.09 55.12,76.83 55.12,72.77 57.66,70.23 57.66,65.53 58.55,64.64 59.94,64.64 60.33,64.26 60.33,54.1 61.21,53.21 v65.15,53.21
P10  (via drill 0.35)
  Top 0.508: X14.4 66.7,92.43 69.47,89.66 69.47,82.3 70.1,81.66 70.1,80.39 70.43,80.06 70.67,80.06 71.74,78.99 71.88,78.99 v71.88,77.85 | v66.93,53.85 67.18,53.59 67.18,40.39 65.73,38.94 IC4.6 61.59,37.34 60.45,37.34 R29.1
  Bottom 0.508: v71.88,77.85 73.66,77.85 75.31,76.2 75.31,68.33 70.61,63.63 70.61,54.99 69.85,54.23 | 69.6,54.23 69.85,54.23 | 69.85,54.23 69.47,53.85 v66.93,53.85
P11  (via drill 0.35)
  Top 0.508: X15.4 87.55,89.41 85.22,89.41 84.2,88.39 84.2,86.87 83.54,86.21 80.42,86.21 80.39,86.23 80.26,86.23 79.12,85.09 79.12,83.19 76.83,80.9 76.83,77.98 78.36,76.45 | 78.36,76.45 78.49,76.45 | 78.36,76.45 78.36,75.44 77.47,74.55 75.31,74.55 74.93,74.17 74.93,66.67 v74.55,66.29 | IC4.7 64.97,36.4 | v68.71,52.96 68.71,43.69 68.07,43.05 68.07,39.5 64.97,36.4 | R30.1 65.41,29.87 65.41,35.97 64.97,36.4
  Bottom 0.508: v68.71,52.96 69.98,52.96 72.01,54.99 72.01,63.75 v74.55,66.29
P12  (via drill 0.35)
  Top 0.508: X16.4 84.86,73.53 80.14,73.53 79.16,72.56 79.16,72.16 76.07,69.07 v76.07,66.17 | v74.3,57.15 73.66,57.15 72.9,56.39 72.9,34.92 71.83,33.86 IC4.9 70.74,33.78 R31.1
  Bottom 0.508: v74.3,57.15 74.3,64.39 v76.07,66.17
P13  (via drill 0.35)
  Top 0.508: X17.4 87.48,62.74 84.84,62.74 83.31,61.21 80.39,61.21 76.58,57.4 v76.58,52.83 | R32.1 v73.28,31.37
  Bottom 0.508: v76.58,52.83 76.58,43.81 73.03,40.26 69.47,40.26 68.33,39.12 68.33,38.1 70.1,36.32 70.74,36.32 | 70.74,36.32 IC4.10 | v73.28,31.37 73.28,35.05 72.01,36.32 70.74,36.32
P14  (via drill 0.35)
  Top 0.508: X18.4 86.16,48.13 79.12,48.13 76.33,45.34 v76.33,41.4 | R33.1 v76.2,31.37
  Bottom 0.508: v76.33,41.4 76.33,41.27 74.3,39.24 71.12,39.24 IC4.11 76.2,33.55 v76.2,31.37
P15  (via drill 0.35)
  Top 0.508: IC4.12 69.93,41.48 68.83,40.39 v68.83,31.5 68.83,31.37 68.2,30.73 R34.1 68.48,29.08 68.83,29.08 | X19.4 86.69,37.16 84.58,35.05 83.06,35.05 83.03,35.03 75.03,35.03 71.75,31.75 v71.75,31.5
  Bottom 0.508: v68.83,31.5 v71.75,31.5
RST
  Bottom 0.508: JP1.5 35.69,57.43 35.69,50.93 37.34,49.28 37.34,43.48
  Bottom 0.813: 37.34,43.48 37.34,42.42 39.62,40.13 U$20.RST
S8
  Top 0.508: IC3.4 50.29,69.01 50.29,69.6 49.66,70.23 47.88,70.23 47.62,70.48 47.62,77.29 R1.1
S9
  Top 0.508: R10.2 53.9,64.57 IC3.5
S10
  Top 0.508: IC3.6 52.7,71.68 52.7,77.22 55.78,80.29 55.78,83.03 R11.2
S11
  Top 0.508: IC3.7 58.93,68 58.93,70.1 56.52,72.52 55.37,72.52 55.12,72.77 55.12,76.71 56.13,77.72 63.42,77.72 R12.2
S12
  Top 0.508: R13.2 64.62,74.19 63.25,75.56 IC3.9
S13
  Top 0.508: IC3.10 59.56,74.98 59.56,73.91 62.46,71.02 R14.2
S14
  Top 0.508: R15.2 65.02,68.37 63.41,69.98 61.09,69.98 56.44,74.62 IC3.11
S15
  Top 0.508: IC3.12 53.9,72.34 56.01,70.23 57.02,70.23 57.66,69.6 57.66,66.17 58.55,65.28 62.36,65.28 63.63,64.01 63.63,63.37 R16.2
V24
  Top 0.508: R50.2 24.66,85.19 U$7.S | R35.2 37.49,84.94 U$8.S | R36.2 50.32,84.94 U$12.S | R37.2 63.14,84.94 U$13.S | U$14.S 74.14,87.63 R38.2 | R39.2 78.97,80.87 80.39,82.3 U$15.S | R40.2 79.48,68.3 80.9,69.72 U$16.S | R41.2 80.24,55.98 U$17.S | R42.2 83.08,43.03 U$18.S
  Top 0.61: U$3.S 13.49,64.54 R44.2 | U$2.S 13.61,77.37 R43.2 | R49.2 12.29,87.38 U$1.S
  Top 0.813: C8.1 20.95,9.41 X22.1 | C4.+ 15.34,15.16 R48.2 | U$6.S 14.1,25.27 14.88,26.06 R47.2 | R46.2 14.76,39.4 12.95,37.59 U$5.S | R45.2 12.98,51.08 U$4.S
  Top 1.016: C4.+ 20.04,11.35 20.07,11.39 C8.1
  Top 1.27: 21.59,9.87 C8.1
  Bottom 1.016: X1.1 11.89,3.61 13.97,1.52 19.18,1.52 20.95,3.3 X22.1
  Bottom 1.27: 15.49,83.69 15.49,84.96 13.08,87.38 U$1.S
  Bottom 2.54: X22.1 15.37,10.67 15.37,24 | 15.37,24 13.97,25.4 11.94,25.4 U$6.S | 15.37,24 15.37,36.32 | 15.37,36.32 14.1,37.59 U$5.S | U$4.S 14.73,49.91 15.37,49.28 | 15.37,36.32 15.37,49.28 | 15.37,49.28 15.37,62.23 14.73,62.87 | U$3.S 14.73,62.87 | 14.73,62.87 14.99,63.12 14.99,74.93 14.22,75.69 | U$2.S 14.22,75.69 | 14.22,75.69 15.49,76.96 15.49,83.69 15.88,84.07 21.46,84.07 | 21.46,84.07 22.1,84.71 U$7.S | 21.46,84.07 34.29,84.07 34.42,83.95 34.67,84.2 | U$8.S 34.67,84.2 | 34.67,84.2 47.24,84.2 47.62,84.58 | U$12.S 47.62,84.58 | 47.62,84.58 47.88,84.33 59.94,84.33 | 59.94,84.33 60.45,84.84 U$13.S | 59.94,84.33 73.03,84.33 73.28,84.58 | 73.28,84.58 U$14.S | U$15.S 79.38,82.3 | 79.38,82.3 77.09,84.58 73.28,84.58 | 79.38,82.3 78.49,81.41 78.49,70.99 | 78.49,70.99 79.76,69.72 U$16.S | 78.49,70.99 78.49,58.17 | 78.49,58.17 79.25,57.4 U$17.S | 78.49,58.17 78.49,45.34 | U$18.S 79.5,44.32 78.49,45.34 | 78.49,45.34 78.49,32.38 79.76,31.11 U$19.S
VCC  (via drill 0.35)
  Top 0.508: U$10.VCC 43.31,28.96 | 43.31,28.7 43.31,41.27 41.83,42.75 | JP1.2 34.59,52.25 | R17.2 34.65,43.59 | R19.2 20.55,39.88 | C3.1 37.83,47.98 | IC3.16 43.74,75.18 46.28,72.64 IC3.2 46.28,64.97 v46.61,64.64 | R27.2 59.89,46.56 IC4.3 64.57,46.56 65.02,46.1 65.02,42.8 61.06,42.8 R28.2 | U$20.VCC 42.8,44.7 42.8,47.75 44.45,49.4 v45.09,49.4 | 68.1,26.42 64.8,26.42 | 73.15,26.52 R31.2 | R33.2 R32.2
  Top 0.61: 41.83,42.75 40.84,42.75 U$20.VCC 37.21,42.67 | 37.21,42.67 34.04,42.67 | 34.04,42.67 31.37,42.67 IC2.16 IC2.1 20.7,40.28 R19.2 18.54,37.87 18.54,36.07 20.04,34.57 R20.2 | R25.2 R26.2 41.55,28.96 43.31,28.96 | R23.2 24.26,20.17 R22.2 R21.2 | R17.2 34.16,42.8 34.04,42.67 | R18.2 37.47,42.93 37.21,42.67 | 37.83,47.98 34.88,50.93 34.8,50.93 34.49,51.23 JP1.2
  Top 0.813: R18.2 37.47,44.96 37.83,45.33 C3.1 | R33.2 73.15,26.52 | R32.2 R31.2 R34.2 | R34.2 68.1,26.42 | R34.2 R30.2 64.8,26.42 61.98,26.42 60.45,27.94 v60.45,28.57 R29.2
  Top 1.016: X11.1 31.11,10.17 C6.1 31.28,13.54 C7.+ | JP1.2 34.49,52.29
  Top 1.27: C7.+ 29.69,18.36 R23.2 R24.2 34.82,20.19 v37.21,20.19 | R25.2 40.28,20.22 v40.26,20.19
  Bottom 0.508: IC4.3 66.99,50.35 | 66.99,50.35 68.28,51.64 IC4.16 | v45.09,49.4 47.24,49.4 | 47.24,49.4 54.1,49.4 54.48,49.02 58.17,49.02 59.5,50.35 66.99,50.35 | 47.24,49.4 47.24,64.01 v46.61,64.64 | U$10.VCC 57.51,21.18 60.45,24.13 v60.45,28.57
  Bottom 0.813: IC1.16 36.78,77.14 38.35,75.56 IC3.16
  Bottom 1.016: X11.1 31.11,2.79 32.38,1.52 39.24,1.52 40.77,3.05 X21.1
  Bottom 1.27: v37.21,20.19 v40.26,20.19

### Text on the board
tPlace: + - | A | B | GND
tNames: 9 | 11 | 7 | 8 | 10 | 1 | 12 | 2 | 13 | 3 | 14 | VCC | 4 | 15 | 5 | 16 | 6 | 2022 | JLCJLCJLCJLC | E-locker.pl / SLAVE / rev 2.2 | 24V | + 5V -